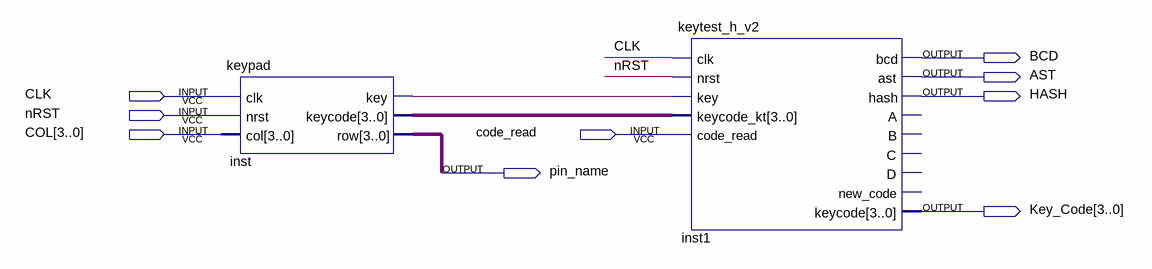
[diagram p0: schematic sheet]
// Quartus schematic keyboard.bdf as structural Verilog: 2 symbols, 9 pins
module keyboard (
  input  CLK,
  input  nRST,
  input  [3:0] COL,
  input  code_read,
  output BCD,
  output AST,
  output HASH,
  output pin_name,
  output [3:0] Key_Code
);

  wire inst_key;
  wire [3:0] inst_keycode, inst_row;

  keypad inst (.clk(CLK), .nrst(nRST), .col(COL), .key(inst_key), .keycode(inst_keycode), .row(inst_row));
  keytest_h_v2 inst1 (
    .clk(CLK), .nrst(nRST), .key(inst_key), .code_read(code_read), .keycode_kt(inst_keycode), .bcd(BCD),
    .ast(AST), .hash(HASH), .keycode(Key_Code));  // open: A, B, C, D, new_code
endmodule
